# EAGLE design d11toy2ccde (EAGLE 6.6.0)
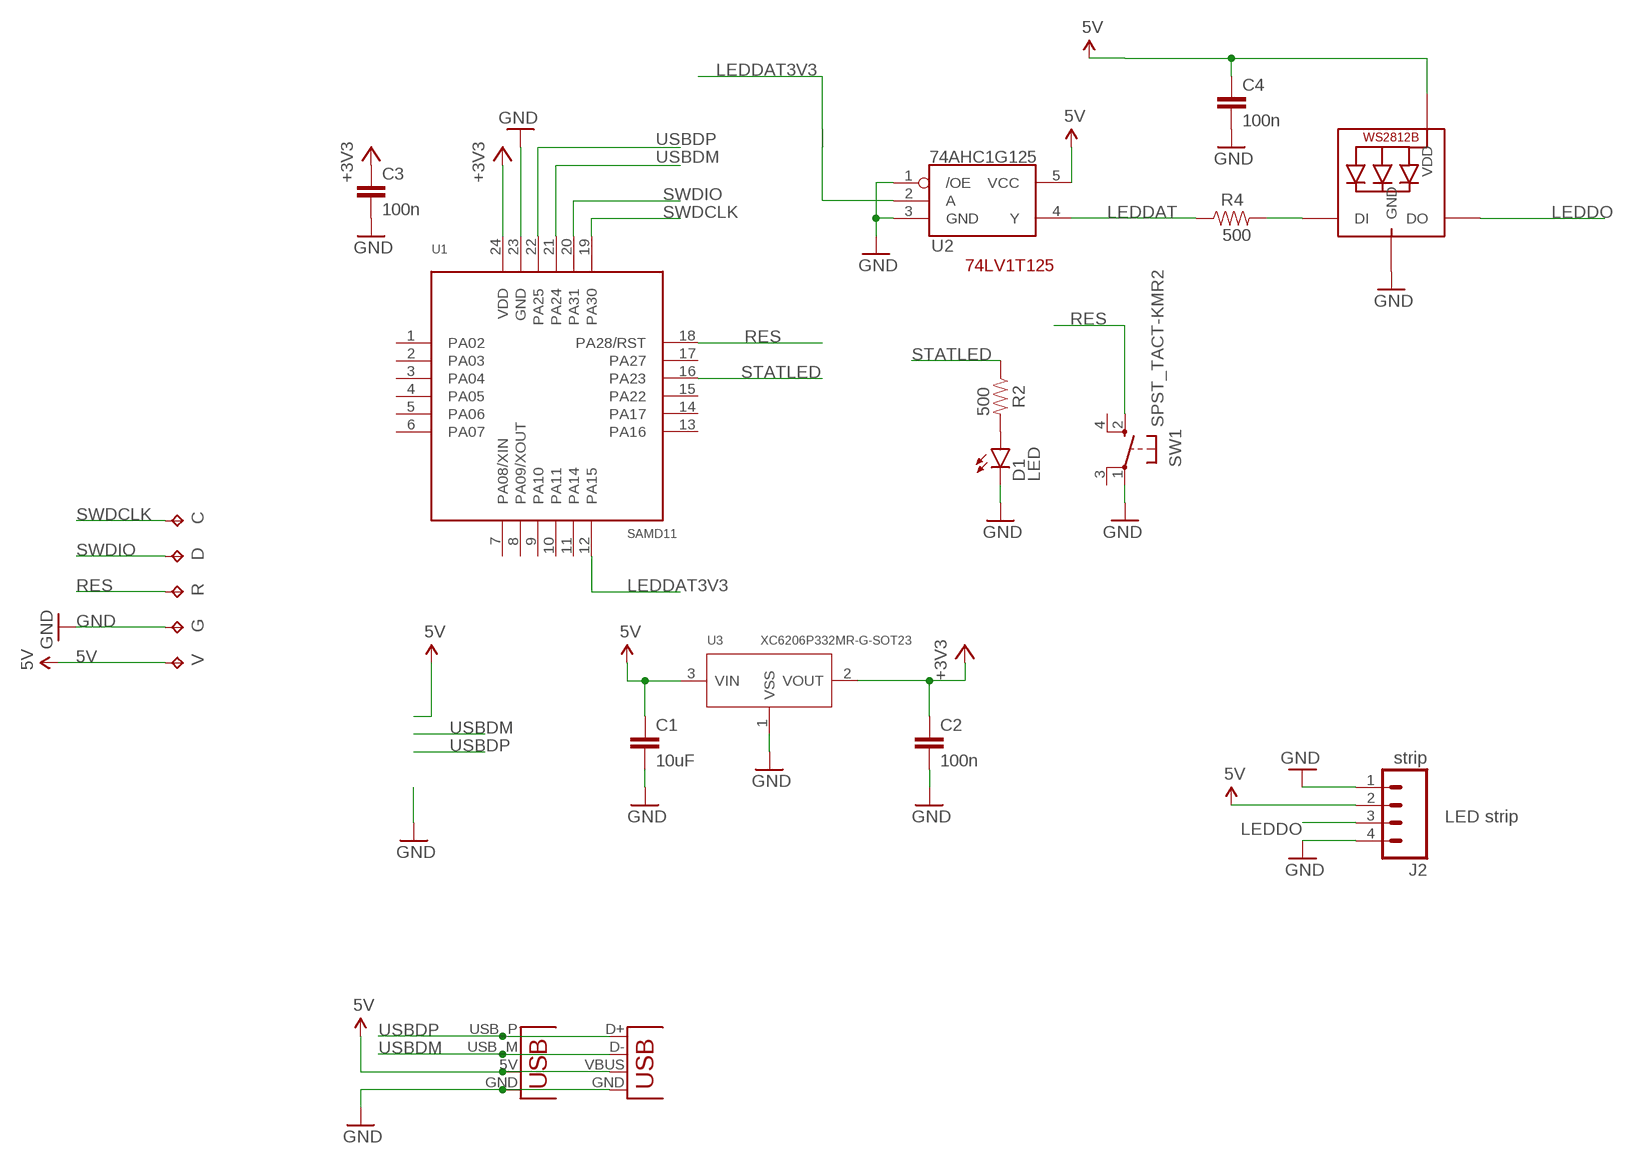
[diagram p0: schematic, sheet 1]

## Parts
C  TPTP08R  [TP08R]
C1  10uF  CAP0603-CAP  [0603-CAP]
C2  100n  CAP0603-CAP  [0603-CAP]
C3  100n  CAP0603-CAP  [0603-CAP]
C4  100n  CAP0603-CAP  [0603-CAP]
D  TPTP08R  [TP08R]
D1  LED  LED0603  [LED-0603]
G  TPTP08R  [TP08R]
J2  strip  M04NO_SILK_ALL_ROUND  [1X04_NO_SILK_ALL_ROUND]
JP1  USBPCB  [USB-A-PCB]
JP3  USB-MICROB  [USB-MICROB]
LED1  WS2812B5050  [WS2812B]
R  TPTP08R  [TP08R]
R2  500  RESISTOR0603-RES  [0603-RES]
R4  500  RESISTOR0603-RES  [0603-RES]
SW1  SPST_TACT-KMR2  [KMR2]
U1  SAMD11  SAMD11D14AM  [QFN24]
U2  74AHC1G125  [SOT23-5]
U3  XC6206P332MR-G-SOT23  PMIC-LDO-XC6206P332MR-G(SOT23)  [SOT-23]
V  TPTP08R  [TP08R]

## Nets
5V: C1.1 C4.1 J2.2 JP1.5V(VBUS) JP3.VBUS LED1.1-VDD(VDD) U2.5(VCC) U3.3(VIN) V.TP
+3V3: C2.1 C3.1 U1.24(VDD) U3.2(VOUT)
GND: C1.2 C2.2 C3.2 C4.2 D1.C G.TP J2.1 J2.4 JP1.GND JP3.GND LED1.3-GND(GND) SW1.1(P) U1.23(GND) U2.1(/OE) U2.3(GND) U3.1(VSS)
LEDDAT: R4.1 U2.4(Y)
LEDDAT3V3: U1.12(PA15) U2.2(A)
LEDDO: J2.3 LED1.2-DOUT(DO)
N$1: D1.A R2.2
N$5: LED1.4-DIN(DI) R4.2
RES: R.TP SW1.2(S) U1.18(PA28/RST)
STATLED: R2.1 U1.16(PA23)
SWDCLK: C.TP U1.19(PA30)
SWDIO: D.TP U1.20(PA31)
USBDM: JP1.USB_M(D-) JP3.D- U1.21(PA24)
USBDP: JP1.USB_P(D+) JP3.D+ U1.22(PA25)
Unconnected: SW1.3(P1) SW1.4(S1) U1.1(PA02) U1.2(PA03) U1.3(PA04) U1.4(PA05) U1.5(PA06) U1.6(PA07) U1.7(PA08/XIN) U1.8(PA09/XOUT) U1.9(PA10) U1.10(PA11) U1.11(PA14) U1.13(PA16) U1.14(PA17) U1.15(PA22) U1.17(PA27)

## Notes on the sheet
- 74LV1T125
- LED strip

## Library data of the parts
C D G R V = testpad:TP: Test pad
C1-C4 = SparkFun-Capacitors:CAP: Capacitor Standard 0603 ceramic capacitor, and 0.1" leaded capacitor.
D1 = SparkFun-LED:LED: LEDs Standard schematic elements and footprints for 5mm, 3mm, 1206, and 0603 sized LEDs. 5mm - Spark Fun Electronics SKU : COM-00529 (and others)
J2 = SparkFun-Connectors:M04: Header 4 Standard 4-pin 0.1" header. Use with straight break away headers (SKU : PRT-00116), right angle break away headers (PRT-00553), swiss pins (PRT-00743), machine pins (PRT-00117), and female headers (PRT-00115). Molex polarized connector foot print use with SKU : PRT-08231 with associated crimp pins and housings. 1MM SMD Version SKU: PRT-10208; PROD_ID: CONN-09696
JP1 = flabbergast:USB: USB Connectors USB-B-PTH is fully proven SKU : PRT-00139/CONN-08278 USB-miniB is fully proven SKU : PRT-00587 USB-A-PCB is untested. USB-A-H is throughly reviewed, but untested. Spark Fun Electronics SKU : PRT-00437 USB-B-SMT is throughly reviewed, but untested. Needs silkscreen touching up. USB-A-S has not been used/tested USB-MB-H has not been used/tested USB-MICROB has been used. CONN-09505
JP3 = flabbergast:USB: USB Connectors USB-B-PTH is fully proven SKU : PRT-00139/CONN-08278 USB-miniB is fully proven SKU : PRT-00587 USB-A-PCB is untested. USB-A-H is throughly reviewed, but untested. Spark Fun Electronics SKU : PRT-00437 USB-B-SMT is throughly reviewed, but untested. Needs silkscreen touching up. USB-A-S has not been used/tested USB-MB-H has not been used/tested USB-MICROB has been used. CONN-09505; PROD_ID: CONN-09505
LED1 = adafruit:WS2812B
R2 R4 = SparkFun-Passives:RESISTOR: Resistor Basic schematic elements and footprints for 0603, 1206, and PTH resistors.
SW1 = adafruit:SPST_TACT: SMT 6mm switch, EVQQ2 series http://www.ladyada.net/library/eagle
U1 = todstuff:SAMD11D14AM: Atmel SAMD11 ATSAMD11D14A - 24-pin QFN
U2 = SparkFun-DigitalIC:74AHC1G125: Single bus buffer gate with 3-state output; PROD_ID: IC-11920
U3 = Seeed-IC-2016:PMIC-LDO-XC6206P332MR-G(SOT23): 310030099; MPN: XC6206P332MR-G

## Board
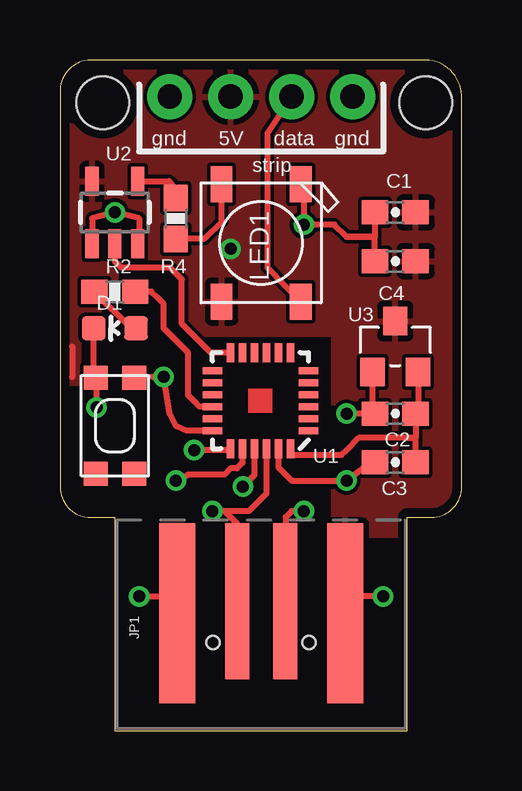
[diagram p1: board, top side]
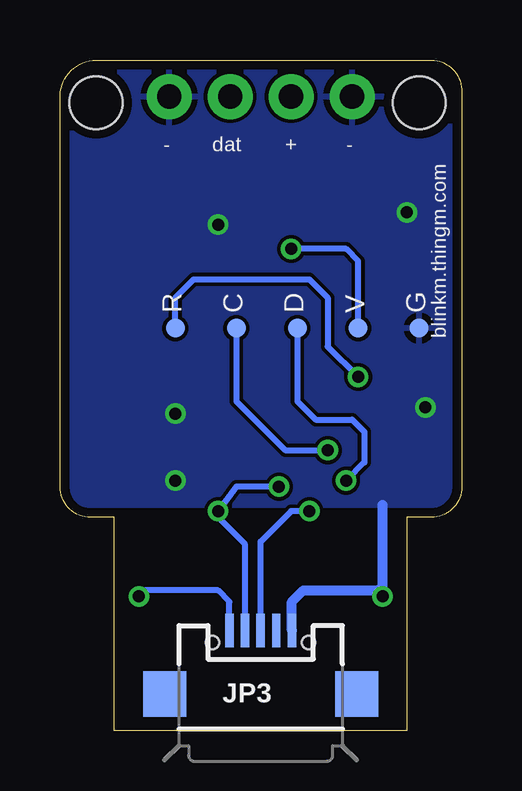
[diagram p2: board, bottom side, seen from below]

Size 16.74 x 27.94 mm. Coordinates in mm from the lower left corner, seen from the top.
Outline: 0,26.59 0,10.16 arc90 1.27,8.89 2.29,8.89 2.29,0 14.48,0 14.48,8.89 15.47,8.89 arc90 16.74,10.16 16.74,26.34 arc90 15.24,27.94 1.27,27.94 arc90 0,26.59
Copper layers (1*16): Top 0.0356mm / dielectric 1.5011mm / Bottom 0.0356mm
Design rules "LaenPCBOrderTodTent": minimum track width 6mil, minimum drill 13mil, track to track 6mil, track to pad 6mil, pad to pad 6mil, via to via 6mil, smd to smd 6mil, copper to edge 15mil, drill to drill 6mil, minimum pad ring 7mil, minimum via ring 7mil, stop-mask expansion 3mil, vias tented up to drill 20mil, thermal gap 10mil
Holes 2.2 mm at 15.24,26.16 1.78,26.16

### Footprints (pad centres in the part's own frame; a part is rotated, then mirrored left to right if it is on the bottom)
TP08R = smd 0.8 x 0.8: TP 0,0
0603-CAP = smd 1.1 x 1: 1 -0.85,0; 2 0.85,0
LED-0603 = smd 1 x 1: A 0,-0.877; C 0,0.877
1X04_NO_SILK_ALL_ROUND = drill 1.016 pad 1.88: 1 0,0; 2 2.54,0; 3 5.08,0; 4 7.62,0
USB-A-PCB = smd 7.5 x 1.5: 5V -0.2,-3.5; GND -0.2,3.5 | smd 6.5 x 1: USB_M 0.3,-1; USB_P 0.3,1
USB-MICROB = smd 0.35 x 1.4: D+ 0,2.65; D- -0.65,2.65; GND 1.3,2.65; ID 0.65,2.65; VBUS -1.3,2.65 | smd 1.8 x 1.9: MT1 -4,0; MT2 4,0 | hole 0.55: -2,2.15; 2,2.15
WS2812B = smd 1.5 x 0.9: 1-VDD 2.45,-1.65; 2-DOUT 2.45,1.65; 3-GND -2.45,1.65; 4-DIN -2.45,-1.65
0603-RES = smd 1.1 x 1: 1 -0.85,0; 2 0.85,0
KMR2 = smd 1 x 1: 1 2,0.8; 2 2,-0.8; 3 -2,0.8; 4 -2,-0.8
QFN24 = smd 0.8 x 0.3: 1 -1.46,0.71; 2 -1.46,0.21; 3 -1.46,-0.29; 4 -1.46,-0.79; 5 -1.46,-1.29; 6 -1.46,-1.79; 13 2.54,-1.79; 14 2.54,-1.29; 15 2.54,-0.79; 16 2.54,-0.29; 17 2.54,0.21; 18 2.54,0.71 | smd 0.3 x 0.8: 7 -0.71,-2.54; 8 -0.21,-2.54; 9 0.29,-2.54; 10 0.79,-2.54; 11 1.29,-2.54; 12 1.79,-2.54; 19 1.79,1.46; 20 1.29,1.46; 21 0.79,1.46; 22 0.29,1.46; 23 -0.21,1.46; 24 -0.71,1.46
SOT23-5 = smd 0.55 x 1.2: 1 -0.95,-1.3; 2 0,-1.3; 3 0.95,-1.3; 4 0.95,1.3; 5 -0.95,1.3
SOT-23 = smd 1.016 x 1.2: 1 -0.95,-1.06; 2 0.95,-1.06; 3 0,1.06

### Placement (x,y rotation side)
C  9.4,16.76 90 bottom
C1  13.97,21.59 180 top
C2  13.97,13.21 180 top
C3  13.97,11.18 180 top
C4  13.97,19.56 180 top
D  6.86,16.76 90 bottom
D1  2.29,16.76 90 top
G  1.78,16.76 90 bottom
J2  4.57,26.42 0 top
JP1  8.38,5.08 90 top
JP3  8.38,1.52 0 bottom
LED1  8.38,20.32 270 top
R  11.94,16.76 90 bottom
R2  2.29,18.29 180 top
R4  4.83,21.34 270 top
SW1  2.29,12.7 90 top
U1  8.89,13.21 180 top
U2  2.29,21.59 0 top
U3  13.97,16 0 top
V  4.32,16.76 90 bottom

### Tracks (layer width: path | path; a pad name or v marks a point on that pad's centre or on a via)
5V  (via drill 0.5)
  Top 0.254: v13.46,5.59 12.59,5.59 JP1.5V | 0.51,16 0.51,14.73
  Bottom 0.254: JP3.VBUS 9.68,5.36 10.16,5.84 13.21,5.84 v13.46,5.59 | V.TP 4.32,19.56 4.83,20.07 v7.11,20.07
  pour Top: -5.08,38.1 17.78,38.1 17.78,8.13 11.43,8.13 11.43,16.51 0.76,16.51 0.76,14.48 -5.08,14.48
+3V3
  Top 0.254: U3.2 14.92,13.31 C2.1 14.82,12.19 | 14.48,12.19 14.82,12.19 | C3.1 14.82,12.19 | 14.82,12.19 14.48,12.19 | U1.24 9.6,11.48 11.74,11.48 11.94,11.68 12.45,12.19 14.48,12.19
GND  (via drill 0.5)
  Top 0.254: LED1.3-GND 10.03,22.86 10.16,22.86 v10.16,21.08 11.43,21.08 11.94,20.57 | C1.2 13.12,20.66 | 11.94,20.57 13.03,20.57 13.12,20.66 | U2.3 3.3,20.36 3.3,21.34 v2.29,21.59 1.34,21.34 U2.1 1.27,20.22 | U3.1 13.02,13.31 C2.2 v11.94,13.21 | C4.2 13.12,20.57 | 13.12,20.57 13.12,20.66 | 13.12,20.66 13.12,20.57 | 13.12,20.57 11.94,20.57 | U1.23 9.1,10.97 | 9.1,10.97 9.4,10.67 | 9.4,10.67 9.65,10.41 9.68,10.41 11.68,10.41 v11.94,10.41 12.95,11.18 C3.2 | 9.4,10.67 9.1,10.97 | 9.1,10.97 9.4,10.67 | 1.52,14.74 SW1.1 | v1.52,13.46 1.52,14.66 SW1.1 | v3.3,5.59 4.17,5.59 JP1.GND | 1.52,14.74 SW1.1 | 1.52,14.74 1.41,14.74 D1.C
  Bottom 0.406: JP3.GND 7.08,5.36 6.6,5.84 3.3,5.84 | 3.3,5.84 3.56,5.84 | 3.56,5.84 v3.3,5.59 | 3.56,5.84 3.3,5.84 | 3.3,5.84 3.3,9.4
  pour Bottom: 17.78,34.29 -1.27,34.29 -1.02,9.4 18.03,9.4
LEDDAT
  Top 0.254: U2.4 4.54,22.89 4.83,22.61 R4.1
LEDDAT3V3
  Top 0.254: U2.2 2.29,19.81 2.29,19.56 2.54,19.3 4.57,19.3 5.08,18.8 5.08,16.94 6.28,15.75 U1.12
LEDDO
  Top 0.254: J2.3 8.64,24.89 8.64,19.3 10.12,17.78 LED1.2-DOUT
N$1
  Top 0.254: R2.2 2.96,16.76 D1.A
N$5
  Top 0.254: 6.51,23.02 LED1.4-DIN 6.73,21.21 6.01,20.49 R4.2
RES  (via drill 0.5)
  Top 0.254: U1.18 5.28,12.5 4.83,12.7 | 4.83,12.7 4.57,13.21 | 4.57,13.21 4.83,12.7 | 4.83,12.7 4.57,13.21 | 4.57,13.21 v4.32,14.73 3.88,14.73 SW1.2
  Bottom 0.254: R.TP 11.94,18.03 11.18,18.8 6.35,18.8 5.59,18.03 5.59,16 v4.32,14.73
STATLED
  Top 0.254: U1.16 5.81,13.5 5.59,13.72 5.33,13.97 5.33,15.75 4.32,16.76 4.32,17.78 4.06,18.03 3.81,18.29 R2.1
SWDCLK  (via drill 0.5)
  Top 0.254: U1.19 7.1,11.68 v5.59,11.68
  Bottom 0.254: C.TP 9.4,13.72 7.37,11.68 v5.59,11.68
SWDIO  (via drill 0.5)
  Top 0.254: U1.20 7.6,11.16 7.37,10.92 7.11,10.92 6.86,10.67 5.33,10.67 v4.83,10.41
  Bottom 0.254: D.TP 6.86,13.72 6.1,12.95 4.57,12.95 4.06,12.45 4.06,11.18 v4.83,10.41
USBDM  (via drill 0.5)
  Top 0.254: U1.21 8.1,10.89 8.1,10.64 v7.62,10.16 | 9.38,7.11 9.38,6.6 | 9.38,6.6 JP1.USB_M | v10.16,9.14 9.65,9.14 9.4,8.89 9.4,6.62 9.38,6.6
  Bottom 0.254: JP3.D- 9.03,6.35 9.03,7.76 10.16,8.89 v10.16,9.14 9.4,10.16 v7.62,10.16
USBDP  (via drill 0.5)
  Top 0.254: U1.22 8.6,9.87 7.87,9.14 v6.35,9.14 6.86,9.14 7.37,8.64 7.37,7.11 7.37,5.4 JP1.USB_P
  Bottom 0.254: JP3.D+ 8.38,6.1 8.38,7.87 7.11,9.14 v6.35,9.14

### Text on the board
tPlace: gnd | 5V | data | strip | gnd | d11toy2ccde | SAMD11D14 | BlinkM Neo
bPlace: blinkm.thingm.com | - | + | dat | -